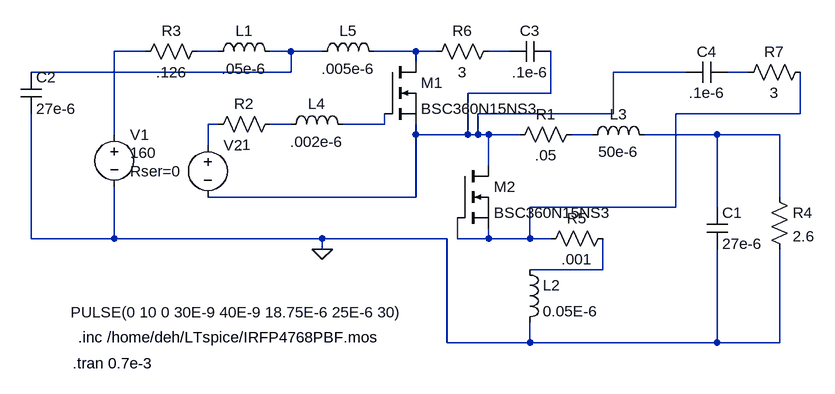
[diagram p0: schematic FET3.asc]
FET3.asc, the LTspice schematic file:
Version 4
SHEET 1 988 680
WIRE -48 -48 -96 -48
WIRE 64 -48 32 -48
WIRE 176 -48 144 -48
WIRE 224 -48 176 -48
WIRE 368 -48 304 -48
WIRE 400 -48 368 -48
WIRE 512 -48 480 -48
WIRE 368 -32 368 -48
WIRE 176 -16 176 -48
WIRE 176 -16 -224 -16
WIRE 784 -16 672 -16
WIRE 880 -16 848 -16
WIRE 576 16 576 -48
WIRE 576 16 448 16
WIRE 672 48 672 -16
WIRE 672 48 464 48
WIRE 960 48 960 -16
WIRE 960 48 768 48
WIRE 64 64 48 64
WIRE 176 64 144 64
WIRE 320 64 320 48
WIRE 320 64 256 64
WIRE -96 80 -96 -48
WIRE 368 80 368 64
WIRE 448 80 448 16
WIRE 448 80 368 80
WIRE 464 80 464 48
WIRE 464 80 448 80
WIRE 480 80 464 80
WIRE 528 80 480 80
WIRE 640 80 608 80
WIRE 832 80 720 80
WIRE 928 80 832 80
WIRE 48 96 48 64
WIRE 480 128 480 80
WIRE 368 176 368 80
WIRE 368 176 48 176
WIRE 928 176 928 80
WIRE 768 192 768 48
WIRE 768 192 544 192
WIRE 832 192 832 80
WIRE -224 240 -224 48
WIRE -96 240 -96 160
WIRE -96 240 -224 240
WIRE 224 240 -96 240
WIRE 416 240 224 240
WIRE 432 240 432 208
WIRE 480 240 480 224
WIRE 480 240 432 240
WIRE 544 240 544 192
WIRE 544 240 480 240
WIRE 576 240 544 240
WIRE 224 256 224 240
WIRE 656 288 656 240
WIRE 656 288 544 288
WIRE 416 400 416 240
WIRE 544 400 544 368
WIRE 544 400 416 400
WIRE 832 400 832 256
WIRE 832 400 544 400
WIRE 928 400 928 256
WIRE 928 400 832 400
FLAG 224 256 0
SYMBOL res 624 64 R90
WINDOW 0 0 56 VBottom 2
WINDOW 3 32 56 VTop 2
SYMATTR InstName R1
SYMATTR Value .05
SYMATTR SpiceLine tol=1 pwr=1e6
SYMBOL res 160 48 R90
WINDOW 0 0 56 VBottom 2
WINDOW 3 32 56 VTop 2
SYMATTR InstName R2
SYMATTR Value .1
SYMATTR SpiceLine tol=5 pwr=0.25
SYMBOL voltage -96 64 R0
WINDOW 3 24 44 Left 2
WINDOW 123 0 0 Left 2
WINDOW 39 24 72 Left 2
SYMATTR Value 160
SYMATTR SpiceLine Rser=0
SYMATTR InstName V1
SYMBOL voltage 48 80 R0
WINDOW 3 -211 273 Left 2
WINDOW 123 0 0 Left 2
WINDOW 39 0 0 Left 2
SYMATTR Value PULSE(0 10 0 30E-9 40E-9 18.75E-6 25E-6 30)
SYMATTR InstName V2
SYMBOL nmos 320 -32 R0
SYMATTR InstName M1
SYMATTR Value BSC360N15NS3
SYMBOL ind 48 -32 R270
WINDOW 0 32 56 VTop 2
WINDOW 3 5 56 VBottom 2
SYMATTR InstName L1
SYMATTR Value .05e-6
SYMATTR SpiceLine Rser=0
SYMBOL ind 528 272 R0
SYMATTR InstName L2
SYMATTR Value 0.05E-6
SYMBOL ind 624 96 R270
WINDOW 0 32 56 VTop 2
WINDOW 3 5 56 VBottom 2
SYMATTR InstName L3
SYMATTR Value 50e-6
SYMBOL res 48 -64 R90
WINDOW 0 0 56 VBottom 2
WINDOW 3 32 56 VTop 2
SYMATTR InstName R3
SYMATTR Value .126
SYMBOL ind 160 80 R270
WINDOW 0 32 56 VTop 2
WINDOW 3 5 56 VBottom 2
SYMATTR InstName L4
SYMATTR Value .002e-6
SYMBOL res 912 160 R0
SYMATTR InstName R4
SYMATTR Value 2.6
SYMBOL cap 816 192 R0
SYMATTR InstName C1
SYMATTR Value 27e-6
SYMBOL res 672 224 R90
WINDOW 0 0 56 VBottom 2
WINDOW 3 32 56 VTop 2
SYMATTR InstName R5
SYMATTR Value .001
SYMBOL cap -240 -16 R0
SYMATTR InstName C2
SYMATTR Value 27e-6
SYMBOL ind 208 -32 R270
WINDOW 0 32 56 VTop 2
WINDOW 3 5 56 VBottom 2
SYMATTR InstName L5
SYMATTR Value .005e-6
SYMBOL res 384 -32 R270
WINDOW 0 32 56 VTop 2
WINDOW 3 0 56 VBottom 2
SYMATTR InstName R6
SYMATTR Value 3
SYMBOL cap 512 -32 R270
WINDOW 0 32 32 VTop 2
WINDOW 3 0 32 VBottom 2
SYMATTR InstName C3
SYMATTR Value .1e-6
SYMBOL nmos 432 128 R0
SYMATTR InstName M2
SYMATTR Value BSC360N15NS3
SYMBOL cap 848 -32 R90
WINDOW 0 0 32 VBottom 2
WINDOW 3 32 32 VTop 2
SYMATTR InstName C4
SYMATTR Value .1e-6
SYMBOL res 976 -32 R90
WINDOW 0 0 56 VBottom 2
WINDOW 3 32 56 VTop 2
SYMATTR InstName R7
SYMATTR Value 3
TEXT -152 392 Left 2 !.inc /home/deh/LTspice/IRFP4768PBF.mos
TEXT -160 432 Left 2 !.tran 0.7e-3

The netlist it stands for:
* FET3.asc
R1 N012 N006 .05 tol=1 pwr=1e6
R2 N010 N009 .1 tol=5 pwr=0.25
V1 N001 0 160 Rser=0
V2 N009 N006 PULSE(0 10 0 30E-9 40E-9 18.75E-6 25E-6 30)
M1 N004 N011 N006 N006 BSC360N15NS3
L1 N002 N003 .05e-6 Rser=0
L2 N014 0 0.05E-6
L3 N012 N013 50e-6
R3 N002 N001 .126
L4 N010 N011 .002e-6
R4 N013 0 2.6
C1 N013 0 27e-6
R5 N014 N008 .001
C2 N003 0 27e-6
L5 N003 N004 .005e-6
R6 N004 N005 3
C3 N005 N006 .1e-6
M2 N006 N008 N008 N008 BSC360N15NS3
C4 N007 N006 .1e-6
R7 N008 N007 3
.model NMOS NMOS
.model PMOS PMOS
.lib standard.mos
.inc /home/deh/LTspice/IRFP4768PBF.mos
.tran 0.7e-3
.backanno
.end